# EAGLE design Current Sensor v0_6 (EAGLE 8.3.0)
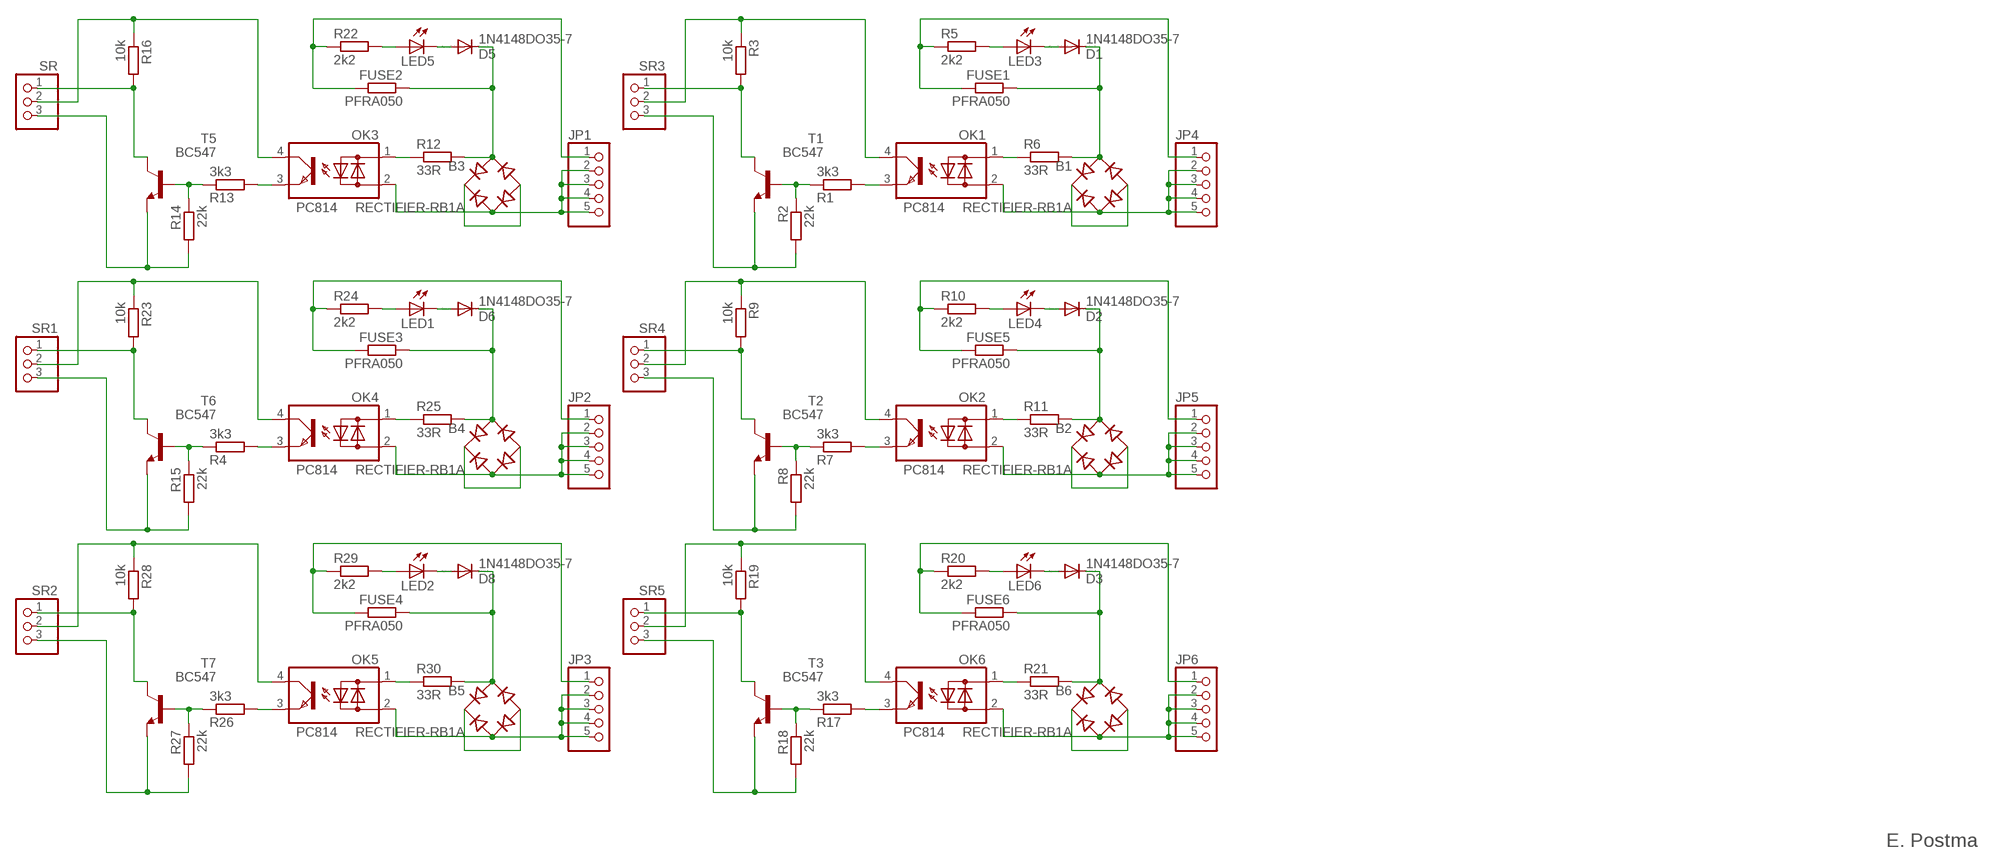
[diagram p0: schematic, sheet 1]

## Parts
B1  RECTIFIER-RB1A  [RB1A]
B2  RECTIFIER-RB1A  [RB1A]
B3  RECTIFIER-RB1A  [RB1A]
B4  RECTIFIER-RB1A  [RB1A]
B5  RECTIFIER-RB1A  [RB1A]
B6  RECTIFIER-RB1A  [RB1A]
D1  1N4148DO35-7  [DO35-7]
D2  1N4148DO35-7  [DO35-7]
D3  1N4148DO35-7  [DO35-7]
D5  1N4148DO35-7  [DO35-7]
D6  1N4148DO35-7  [DO35-7]
D8  1N4148DO35-7  [DO35-7]
FUSE1  PFRA050  R-EU_0414/5V  [0414V]
FUSE2  PFRA050  R-EU_0414/5V  [0414V]
FUSE3  PFRA050  R-EU_0414/5V  [0414V]
FUSE4  PFRA050  R-EU_0414/5V  [0414V]
FUSE5  PFRA050  R-EU_0414/5V  [0414V]
FUSE6  PFRA050  R-EU_0414/5V  [0414V]
JP1  PINHD-1X5  [1X05]
JP2  PINHD-1X5  [1X05]
JP3  PINHD-1X5  [1X05]
JP4  PINHD-1X5  [1X05]
JP5  PINHD-1X5  [1X05]
JP6  PINHD-1X5  [1X05]
LED1  LED3MM  [LED3MM]
LED2  LED3MM  [LED3MM]
LED3  LED3MM  [LED3MM]
LED4  LED3MM  [LED3MM]
LED5  LED3MM  [LED3MM]
LED6  LED3MM  [LED3MM]
OK1  PC814  [DIL04]
OK2  PC814  [DIL04]
OK3  PC814  [DIL04]
OK4  PC814  [DIL04]
OK5  PC814  [DIL04]
OK6  PC814  [DIL04]
R1  3k3  R-EU_0207/7  [0207/7]
R2  22k  R-EU_0207/7  [0207/7]
R3  10k  R-EU_0207/7  [0207/7]
R4  3k3  R-EU_0207/7  [0207/7]
R5  2k2  R-EU_0207/7  [0207/7]
R6  33R  R-EU_0207/7  [0207/7]
R7  3k3  R-EU_0207/7  [0207/7]
R8  22k  R-EU_0207/7  [0207/7]
R9  10k  R-EU_0207/7  [0207/7]
R10  2k2  R-EU_0207/7  [0207/7]
R11  33R  R-EU_0207/7  [0207/7]
R12  33R  R-EU_0207/7  [0207/7]
R13  3k3  R-EU_0207/7  [0207/7]
R14  22k  R-EU_0207/7  [0207/7]
R15  22k  R-EU_0207/7  [0207/7]
R16  10k  R-EU_0207/7  [0207/7]
R17  3k3  R-EU_0207/7  [0207/7]
R18  22k  R-EU_0207/7  [0207/7]
R19  10k  R-EU_0207/7  [0207/7]
R20  2k2  R-EU_0207/7  [0207/7]
R21  33R  R-EU_0207/7  [0207/7]
R22  2k2  R-EU_0207/7  [0207/7]
R23  10k  R-EU_0207/7  [0207/7]
R24  2k2  R-EU_0207/7  [0207/7]
R25  33R  R-EU_0207/7  [0207/7]
R26  3k3  R-EU_0207/7  [0207/7]
R27  22k  R-EU_0207/7  [0207/7]
R28  10k  R-EU_0207/7  [0207/7]
R29  2k2  R-EU_0207/7  [0207/7]
R30  33R  R-EU_0207/7  [0207/7]
SR  PINHD-1X3  [1X03]
SR1  PINHD-1X3  [1X03]
SR2  PINHD-1X3  [1X03]
SR3  PINHD-1X3  [1X03]
SR4  PINHD-1X3  [1X03]
SR5  PINHD-1X3  [1X03]
T1  BC547  [TO92]
T2  BC547  [TO92]
T3  BC547  [TO92]
T5  BC547  [TO92]
T6  BC547  [TO92]
T7  BC547  [TO92]

## Nets
N$1: OK3.1(AC1) R12.1
N$2: OK1.1(AC1) R6.1
N$3: LED3.A R5.2
N$4: D1.A LED3.K(C)
N$5 [Rijstroom+]: B1.AC1 D1.C FUSE1.1 R6.2
N$6 [Rijstroom+]: B1.+ B1.-
N$7 [Rijstroom+]: FUSE1.2 JP4.1 R5.1
N$8 [Rijstroom+]: B1.AC2 JP4.2 JP4.3 JP4.4 JP4.5 OK1.2(AC2)
N$9: R1.1 R2.1 T1.2(B)
N$10: R3.2 SR3.1 T1.3(C)
N$11: OK1.3(E) R1.2
N$12 [5V]: OK1.4(C) R3.1 SR3.2
N$13 [Gnd]: R2.2 SR3.3 T1.1(E)
N$14: OK2.1(AC1) R11.1
N$15: LED4.A R10.2
N$16: D2.A LED4.K(C)
N$17 [Rijstroom+]: B2.AC1 D2.C FUSE5.1 R11.2
N$18 [Rijstroom+]: B2.+ B2.-
N$19 [Rijstroom+]: FUSE5.2 JP5.1 R10.1
N$20 [Rijstroom+]: B2.AC2 JP5.2 JP5.3 JP5.4 JP5.5 OK2.2(AC2)
N$21: R7.1 R8.1 T2.2(B)
N$22: R9.2 SR4.1 T2.3(C)
N$23: OK2.3(E) R7.2
N$24: LED5.A R22.2
N$25: D5.A LED5.K(C)
N$26 [5V]: OK2.4(C) R9.1 SR4.2
N$27 [Gnd]: R8.2 SR4.3 T2.1(E)
N$28: OK6.1(AC1) R21.1
N$29: LED6.A R20.2
N$30 [Rijstroom+]: B3.AC1 D5.C FUSE2.1 R12.2
N$31: D3.A LED6.K(C)
N$32 [Rijstroom+]: B6.AC1 D3.C FUSE6.1 R21.2
N$33 [Rijstroom+]: B6.+ B6.-
N$34 [Rijstroom+]: FUSE6.2 JP6.1 R20.1
N$35 [Rijstroom+]: B6.AC2 JP6.2 JP6.3 JP6.4 JP6.5 OK6.2(AC2)
N$36 [Rijstroom+]: B3.+ B3.-
N$37 [Rijstroom+]: FUSE2.2 JP1.1 R22.1
N$38: R13.1 R14.1 T5.2(B)
N$39: R16.2 SR.1 T5.3(C)
N$40 [Rijstroom+]: B3.AC2 JP1.2 JP1.3 JP1.4 JP1.5 OK3.2(AC2)
N$41: R17.1 R18.1 T3.2(B)
N$42: R19.2 SR5.1 T3.3(C)
N$43: OK3.3(E) R13.2
N$44: OK4.1(AC1) R25.1
N$45 [5V]: OK3.4(C) R16.1 SR.2
N$46: OK6.3(E) R17.2
N$47: LED1.A R24.2
N$48: D6.A LED1.K(C)
N$49 [5V]: OK6.4(C) R19.1 SR5.2
N$50 [Gnd]: R18.2 SR5.3 T3.1(E)
N$51 [Rijstroom+]: B4.AC1 D6.C FUSE3.1 R25.2
N$52 [Rijstroom+]: B4.+ B4.-
N$53 [Rijstroom+]: FUSE3.2 JP2.1 R24.1
N$54 [Rijstroom+]: B4.AC2 JP2.2 JP2.3 JP2.4 JP2.5 OK4.2(AC2)
N$55: R4.1 R15.1 T6.2(B)
N$56: R23.2 SR1.1 T6.3(C)
N$57: OK4.3(E) R4.2
N$59 [5V]: OK4.4(C) R23.1 SR1.2
N$60 [Gnd]: R14.2 SR.3 T5.1(E)
N$61 [Gnd]: R15.2 SR1.3 T6.1(E)
N$62: OK5.1(AC1) R30.1
N$63: LED2.A R29.2
N$64: D8.A LED2.K(C)
N$65 [Rijstroom+]: B5.AC1 D8.C FUSE4.1 R30.2
N$66 [Rijstroom+]: B5.+ B5.-
N$67 [Rijstroom+]: FUSE4.2 JP3.1 R29.1
N$68 [Rijstroom+]: B5.AC2 JP3.2 JP3.3 JP3.4 JP3.5 OK5.2(AC2)
N$69: R26.1 R27.1 T7.2(B)
N$70: R28.2 SR2.1 T7.3(C)
N$71: OK5.3(E) R26.2
N$72 [5V]: OK5.4(C) R28.1 SR2.2
N$73 [Gnd]: R27.2 SR2.3 T7.1(E)

## Notes on the sheet
- E. Postma

## Library data of the parts
B1-B6 = rectifier:RECTIFIER-: Rectifier
D1-D3 D5 D6 D8 = diode:1N4148: DIODE high speed (Philips)
FUSE1-FUSE6 R1-R30 = resistor:R-EU_: RESISTOR, European symbol
JP1-JP6 = pinhead:PINHD-1X5: PIN HEADER
LED1-LED6 = led:LED: LED OSRAM: - CHIPLED LG R971, LG N971, LY N971, LG Q971, LY Q971, LO R971, LY R971 LH N974, LH R974 LS Q976, LO Q976, LY Q976 LO Q996 - Hyper CHIPLED LW Q18S LB Q993, LB Q99A, LB R99A - SideLED LS A670, LO A670, LY A670, LG A670, LP A670 LB A673, LV A673, LT A673, LW A673 LH A674 LY A675 LS A676, LA A676, LO A676, LY A676, LW A676 LS A679, LY A679, LG A679 - Hyper Micro SIDELED® LS Y876, LA Y876, LO Y876, LY Y876 LT Y87S - SmartLED LW L88C, LW L88S LB L89C, LB L89S, LG L890 LS L89K, LO L89K, LY L89K LS L896, LA L896, LO L896, LY L896 - TOPLED LS T670, LO T670, LY T670, LG T670, LP T670 LSG T670, LSP T670, LSY T670, LOP T670, LYG T670 LG T671, LOG T671, LSG T671 LB T673, LV T673, LT T673, LW T673 LH T674 LS T676, LA T676, LO T676, LY T676, LB T676, LH T676, LSB T676, LW T676 LB T67C, LV T67C, LT T67C, LS T67K, LO T67K, LY T67K, LW E67C LS E67B, LA E67B, LO E67B, LY E67B, LB E67C, LV E67C, LT E67C LW T67C LS T679, LY T679, LG T679 LS T770, LO T770, LY T770, LG T770, LP T770 LB T773, LV T773, LT T773, LW T773 LH T774 LS E675, LA E675, LY E675, LS T675 LS T776, LA T776, LO T776, LY T776, LB T776 LHGB T686 LT T68C, LB T68C - Hyper Mini TOPLED® LB M676 - Mini TOPLED Santana® LG M470 LS M47K, LO M47K, LY M47K Source: http://www.osram.convergy.de LUXEON: - LUMILED® LXK2-PW12-R00, LXK2-PW12-S00, LXK2-PW14-U00, LXK2-PW14-V00 LXK2-PM12-R00, LXK2-PM12-S00, LXK2-PM14-U00 LXK2-PE12-Q00, LXK2-PE12-R00, LXK2-PE12-S00, LXK2-PE14-T00, LXK2-PE14-U00 LXK2-PB12-K00, LXK2-PB12-L00, LXK2-PB12-M00, LXK2-PB14-N00, LXK2-PB14-P00, LXK2-PB14-Q00 LXK2-PR12-L00, LXK2-PR12-M00, LXK2-PR14-Q00, LXK2-PR14-R00 LXK2-PD12-Q00, LXK2-PD12-R00, LXK2-PD12-S00 LXK2-PH12-R00, LXK2-PH12-S00 LXK2-PL12-P00, LXK2-PL12-Q00, LXK2-PL12-R00 Source: www.luxeon.com KINGBRIGHT: KA-3528ASYC Source: www.kingbright.com
OK1-OK6 = optocoupler:PC814: SHARP OPTO COUPLER; OC_FARNELL: 9707662; OC_NEWARK: unknown
SR SR1-SR5 = pinhead:PINHD-1X3: PIN HEADER
T1-T3 T5-T7 = transistor:BC547: NPN TRANSISTOR

## Net classes
0 default: width 0.508 mm, clearance 0.254 mm
1 5V: width 0.762 mm, clearance 0.254 mm
2 Gnd: width 0.762 mm, clearance 0.254 mm
3 Extra: width 1.016 mm, clearance 0.254 mm
4 Rijstroom+: width 1.016 mm, clearance 0.254 mm
5 3.3V: width 0.508 mm, clearance 0.254 mm
6 Rijstroom-: width 1.016 mm, clearance 0.254 mm

## Board
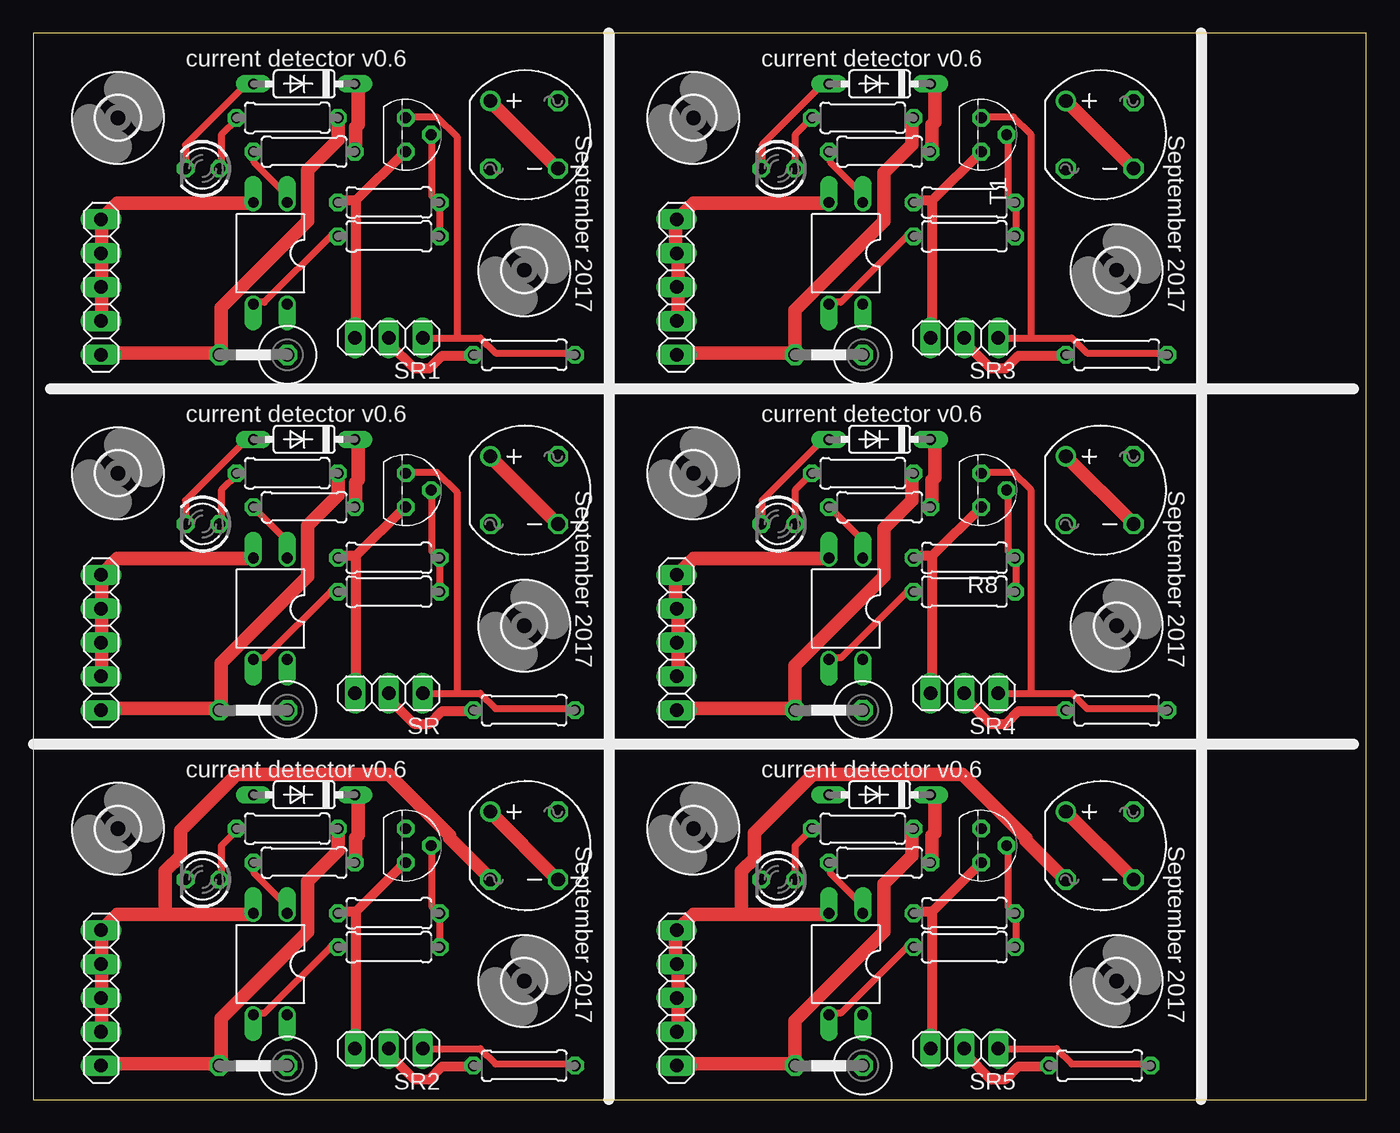
[diagram p1: board, top side]
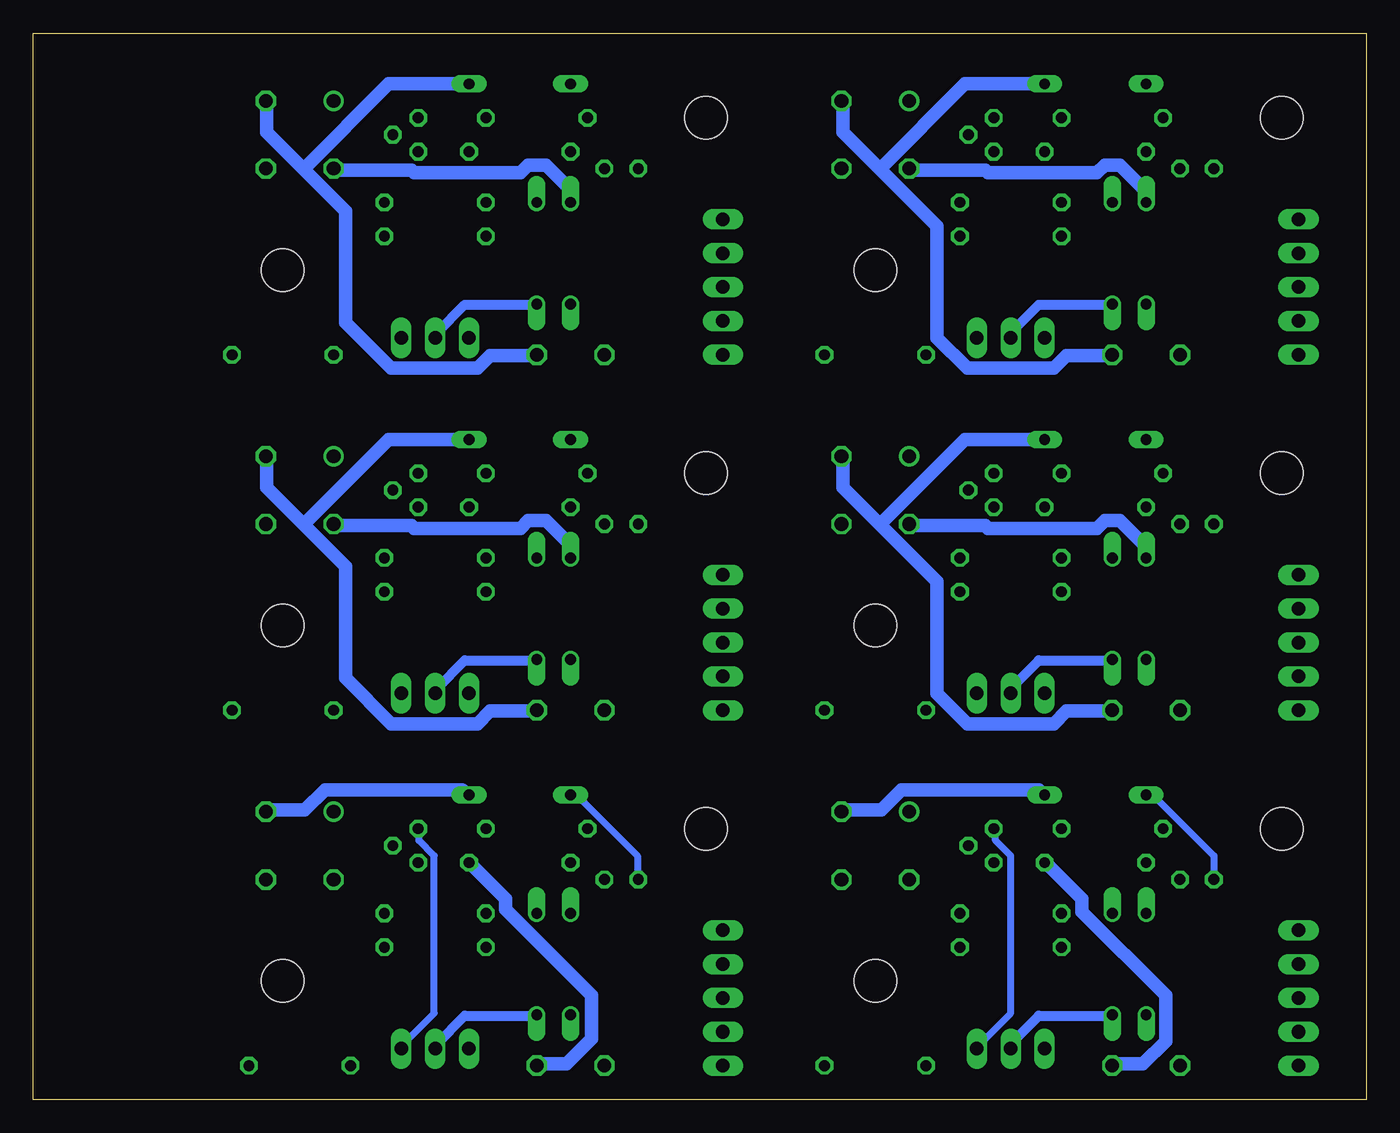
[diagram p2: board, bottom side, seen from below]

Size 100 x 80 mm. Coordinates in mm from the lower left corner, seen from the top.
Outline: 0,0 100,0 100,80 0,80 0,0
Copper layers (1*16): Top 0.035mm / dielectric 1.5mm / Bottom 0.035mm
Design rules "NOA Eagle Rule 2016-06-12": minimum track width 6mil, minimum drill 0.3mm, track to track 6mil, track to pad 6mil, pad to pad 6mil, via to via 6mil, smd to smd 0mil, copper to edge 0.4mm, drill to drill 10mil, minimum pad ring 10mil, minimum via ring 6mil, stop-mask expansion 2mil, vias tented up to drill 25mil, thermal gap 10mil

### Footprints (pad centres in the part's own frame; a part is rotated, then mirrored left to right if it is on the bottom)
RB1A = drill 1.016: + -2.54,2.54 | drill 1.016 octagon: - 2.54,-2.54; AC1 2.54,2.54; AC2 -2.54,-2.54
DO35-7 = drill 0.813 long: A 3.81,0; C -3.81,0
0414V = drill 1.016 octagon: 1 -2.54,0; 2 2.54,0
1X05 = drill 1.016 long: 1 -5.08,0; 2 -2.54,0; 3 0,0; 4 2.54,0; 5 5.08,0
LED3MM = drill 0.813 octagon: A -1.27,0; K 1.27,0
DIL04 = drill 0.813 offset: 1 -1.27,-3.81; 2 1.27,-3.81; 3 1.27,3.81; 4 -1.27,3.81
0207/7 = drill 0.813 octagon: 1 -3.81,0; 2 3.81,0
1X03 = drill 1.016 long: 1 -2.54,0; 2 0,0; 3 2.54,0
TO92 = drill 0.813 octagon: 1 1.27,0; 2 0,1.905; 3 -1.27,0
3,2 = hole 3.2: 0,0

### Placement (x,y rotation side)
B1  80.01,72.39 0 top
B2  80.01,45.72 0 top
B3  36.83,45.72 0 top
B4  36.83,72.39 0 top
B5  36.83,19.05 0 top
B6  80.01,19.05 0 top
D1  63.5,76.2 180 top
D2  63.5,49.53 180 top
D3  63.5,22.86 180 top
D5  20.32,49.53 180 top
D6  20.32,76.2 180 top
D8  20.32,22.86 180 top
FUSE1  59.69,55.88 180 top
FUSE2  16.51,29.21 180 top
FUSE3  16.51,55.88 180 top
FUSE4  16.51,2.54 180 top
FUSE5  59.69,29.21 180 top
FUSE6  59.69,2.54 180 top
JP1  5.08,34.29 90 top
JP2  5.08,60.96 90 top
JP3  5.08,7.62 90 top
JP4  48.26,60.96 90 top
JP5  48.26,34.29 90 top
JP6  48.26,7.62 90 top
LED1  12.7,69.85 180 top
LED2  12.7,16.51 180 top
LED3  55.88,69.85 180 top
LED4  55.88,43.18 180 top
LED5  12.7,43.18 180 top
LED6  55.88,16.51 180 top
OK1  60.96,63.5 180 top
OK2  60.96,36.83 180 top
OK3  17.78,36.83 180 top
OK4  17.78,63.5 180 top
OK5  17.78,10.16 180 top
OK6  60.96,10.16 180 top
R1  69.85,64.77 180 top
R2  69.85,67.31 180 top
R3  81.28,55.88 0 top
R4  26.67,64.77 180 top
R5  62.23,73.66 180 top
R6  63.5,71.12 0 top
R7  69.85,38.1 180 top
R8  69.85,40.64 180 top
R9  81.28,29.21 0 top
R10  62.23,46.99 180 top
R11  63.5,44.45 0 top
R12  20.32,44.45 0 top
R13  26.67,38.1 180 top
R14  26.67,40.64 180 top
R15  26.67,67.31 180 top
R16  36.83,29.21 0 top
R17  69.85,11.43 180 top
R18  69.85,13.97 180 top
R19  80.01,2.54 0 top
R20  62.23,20.32 180 top
R21  63.5,17.78 0 top
R22  19.05,46.99 180 top
R23  36.83,55.88 0 top
R24  19.05,73.66 180 top
R25  20.32,71.12 0 top
R26  26.67,11.43 180 top
R27  26.67,13.97 180 top
R28  36.83,2.54 0 top
R29  19.05,20.32 180 top
R30  20.32,17.78 0 top
SR  26.67,30.48 180 top
SR1  26.67,57.15 180 top
SR2  26.67,3.81 180 top
SR3  69.85,57.15 180 top
SR4  69.85,30.48 180 top
SR5  69.85,3.81 180 top
T1  71.12,72.39 270 top
T2  71.12,45.72 270 top
T3  71.12,19.05 270 top
T5  27.94,45.72 270 top
T6  27.94,72.39 270 top
T7  27.94,19.05 270 top
U$1  [3,2]  49.53,73.66 0 top
U$2  [3,2]  81.28,62.23 0 top
U$3  [3,2]  49.53,46.99 0 top
U$4  [3,2]  81.28,35.56 0 top
U$5  [3,2]  6.35,46.99 0 top
U$6  [3,2]  36.83,35.56 0 top
U$7  [3,2]  6.35,73.66 0 top
U$8  [3,2]  36.83,62.23 0 top
U$9  [3,2]  6.35,20.32 0 top
U$10  [3,2]  36.83,8.89 0 top
U$11  [3,2]  49.53,20.32 0 top
U$12  [3,2]  81.28,8.89 0 top

### Tracks (layer width: path | path; a pad name or v marks a point on that pad's centre or on a via)
N$1
  Top 0.508: OK3.1 19.05,41.91 R12.1
N$2
  Top 0.508: R6.1 59.82,71.06 59.82,70.29 62.1,68.01 62.1,67.44 OK1.1
N$3
  Top 0.508: LED3.A 57.15,72.39 R5.2
N$4
  Top 0.508: D1.A 59.24,76.2 54.67,71.63 54.67,69.91 LED3.K
N$5
  Top 1.016: R6.2 67.44,71.25 67.44,73.15 67.63,73.34 67.63,76.01 67.44,76.2 D1.C
  Bottom 1.016: 79.72,69.82 82.49,72.58 82.49,74.87 B1.AC1 | 79.72,69.82 76.58,66.67 76.58,58.29 73.15,54.86 66.67,54.86 65.72,55.82 62.29,55.82 FUSE1.1 | D1.C 73.34,76.2 79.72,69.82
N$6
  Top 1.016: B1.+ B1.-
N$7
  Top 1.016: R5.1 65.91,73.53 65.91,71.63 63.82,69.53 63.82,65.91 57.15,59.24 FUSE1.2 56.77,56.01 48.39,56.01 JP4.1
N$8
  Top 1.016: JP4.2 48.39,58.48 48.39,60.96 JP4.3 48.39,61.34 48.39,63.06 JP4.4 48.2,63.63 48.2,65.53 JP4.5 48.39,66.1 49.53,67.25 59.63,67.25 OK1.2
  Bottom 1.016: B1.AC2 77.34,69.72 71.63,69.72 71.44,69.53 63.44,69.53 62.87,70.1 61.53,70.1 59.82,68.39 59.82,67.44 OK1.2
N$9
  Top 0.508: R1.1 73.72,64.77 73.72,67.25 R2.1 73.15,67.82 73.15,72.39 T1.2
N$10
  Top 0.508: SR3.1 74.87,57.15 | 74.87,57.15 77.92,57.15 79.06,56.01 84.96,56.01 R3.2 | 74.87,57.15 74.87,72.39 73.53,73.72 71.25,73.72 T1.3
N$11
  Top 0.508: R1.2 65.53,64.77 60.58,59.82 59.82,59.82 OK1.3
N$12
  Top 0.762: R3.1 77.34,55.82 73.91,55.82 72.96,54.86 71.82,54.86 69.91,56.77 69.91,57.15 SR3.2
  Bottom 0.762: OK1.4 62.29,59.63 67.63,59.63 69.72,57.53 69.72,57.15 SR3.2
N$13
  Top 0.762: 67.44,67.44 66.1,67.44 R2.2 | T1.1 67.44,67.44 | 67.44,67.44 67.44,57.15 SR3.3
N$14
  Top 0.508: OK2.1 62.1,40.77 62.1,42.1 59.82,44.39 R11.1
N$15
  Top 0.508: LED4.A 57.15,45.72 R10.2
N$16
  Top 0.508: D2.A 59.24,49.53 54.67,44.96 54.67,43.24 LED4.K
N$17
  Top 1.016: R11.2 67.44,44.58 67.44,46.48 67.63,46.67 67.63,49.34 67.44,49.53 D2.C
  Bottom 1.016: 79.72,43.15 82.49,45.91 82.49,48.2 B2.AC1 | 79.72,43.15 76.58,40.01 76.58,31.62 73.15,28.19 66.67,28.19 65.72,29.15 62.29,29.15 FUSE5.1 | D2.C 73.34,49.53 79.72,43.15
N$18
  Top 1.016: B2.+ B2.-
N$19
  Top 1.016: R10.1 65.91,46.86 65.91,44.96 63.82,42.86 63.82,39.24 57.15,32.58 FUSE5.2 56.77,29.34 48.39,29.34 JP5.1
N$20
  Top 1.016: JP5.2 48.39,31.81 48.39,34.29 JP5.3 48.39,34.67 48.39,36.39 JP5.4 48.2,36.96 48.2,38.86 JP5.5 48.39,39.43 49.53,40.58 59.63,40.58 OK2.2
  Bottom 1.016: B2.AC2 77.34,43.05 71.63,43.05 71.44,42.86 63.44,42.86 62.87,43.43 61.53,43.43 59.82,41.72 59.82,40.77 OK2.2
N$21
  Top 0.508: R7.1 73.72,38.1 73.72,40.58 R8.1 73.15,41.15 73.15,45.72 T2.2
N$22
  Top 0.508: SR4.1 74.87,30.48 | 74.87,30.48 77.92,30.48 79.06,29.34 84.96,29.34 R9.2 | 74.87,30.48 74.87,45.72 73.53,47.05 71.25,47.05 T2.3
N$23
  Top 0.508: R7.2 65.53,38.1 60.58,33.15 59.82,33.15 OK2.3
N$24
  Top 0.508: LED5.A 14.1,43.24 14.1,45.72 15.24,46.86 R22.2
N$25
  Top 0.508: LED5.K 11.43,44.96 16,49.53 D5.A
N$26
  Top 0.762: R9.1 77.34,29.15 73.91,29.15 72.96,28.19 71.82,28.19 69.91,30.1 69.91,30.48 SR4.2
  Bottom 0.762: OK2.4 62.29,32.96 67.63,32.96 69.72,30.86 69.72,30.48 SR4.2
N$27
  Top 0.762: 67.44,40.77 66.1,40.77 R8.2 | T2.1 67.44,40.77 | 67.44,40.77 67.44,30.48 SR4.3
N$28
  Top 0.508: R21.1 59.82,17.72 59.82,16.95 62.1,14.67 62.1,14.1 OK6.1
N$29
  Top 0.508: LED6.A 57.15,19.05 R20.2
N$30
  Top 1.016: R12.2 24.19,44.58 24.19,46.29 24.38,46.48 24.38,49.34 24.19,49.53 D5.C
  Bottom 1.016: 36.48,43.15 39.24,45.91 39.24,48.2 B3.AC1 | 36.48,43.15 32.19,38.86 32.19,30.48 29.91,28.19 23.43,28.19 22.48,29.15 19.05,29.15 FUSE2.1 | D5.C 30.1,49.53 36.48,43.15
N$31
  Bottom 0.508: D3.A 59.24,22.86 54.67,18.29 54.67,16.57 LED6.K
N$32
  Top 1.016: R21.2 67.44,17.91 67.44,19.81 67.63,20 67.63,22.67 67.44,22.86 D3.C
  Bottom 1.016: R21.2 64.58,15.05 64.58,14.29 58.1,7.81 58.1,4.57 60.01,2.67 62.1,2.67 FUSE6.1 | B6.AC1 82.49,21.72 79.63,21.72 78.11,23.24 67.82,23.24 67.44,22.86 D3.C
N$33
  Top 1.016: B6.+ B6.-
N$34
  Top 1.016: R20.1 65.91,20.19 65.91,18.29 63.82,16.19 63.82,12.57 57.15,5.91 FUSE6.2 56.77,2.67 48.39,2.67 JP6.1
N$35
  Top 1.016: JP6.2 48.39,5.14 48.39,7.62 JP6.3 48.39,8 48.39,9.72 JP6.4 48.2,10.29 48.2,12.19 JP6.5 48.39,12.76 49.53,13.91 53.15,13.91 | 53.15,13.91 59.63,13.91 OK6.2 | 53.15,13.91 53.15,17.14 54.1,18.1 54.1,20 58.48,24.38 69.72,24.38 74.49,19.62 74.49,19.43 77.34,16.57 B6.AC2
N$36
  Top 1.016: B3.- 39.24,43.24 34.29,48.2 B3.+
N$37
  Top 1.016: R22.1 22.86,45.34 20.57,43.05 20.57,39.24 14.1,32.77 14.1,29.34 FUSE2.2 13.53,29.34 5.14,29.34 JP1.1
N$38
  Top 0.508: R13.1 R14.1 30.29,40.77 29.91,41.15 29.91,45.72 T5.2
N$39
  Top 0.508: SR.1 31.81,30.48 | 31.81,30.48 33.53,30.48 34.67,29.34 40.58,29.34 R16.2 | 31.81,30.48 31.81,45.53 30.29,47.05 28,47.05 T5.3
N$40
  Top 1.016: JP1.2 5.14,31.81 5.14,34.29 JP1.3 5.14,34.67 5.14,36.39 JP1.4 5.14,36.96 5.14,39.05 JP1.5 6.29,40.58 16.38,40.58 OK3.2
  Bottom 1.016: B3.AC2 34.29,43.05 28.57,43.05 28.38,42.86 20.19,42.86 19.62,43.43 18.48,43.43 16.57,41.53 16.57,40.77 OK3.2
N$41
  Top 0.508: R17.1 73.72,11.43 73.72,13.91 R18.1 73.15,14.48 73.15,19.05 T3.2
N$42
  Top 0.508: SR5.1 76.77,3.81 77.92,2.67 83.82,2.67 R19.2
  Bottom 0.508: SR5.1 72.39,4 69.91,6.48 69.91,18.29 71.06,19.43 71.06,20.19 T3.3
N$43
  Top 0.508: R13.2 22.29,38.1 17.34,33.15 16.57,33.15 OK3.3
N$44
  Top 0.508: OK4.1 19.05,67.82 16.57,70.29 16.57,71.06 R25.1
N$45
  Top 0.762: SR.2 26.67,30.1 28.57,28.19 29.72,28.19 30.67,29.15 32.96,29.15 R16.1
  Bottom 0.762: SR.2 26.67,30.86 24.57,32.96 19.05,32.96 OK3.4
N$46
  Top 0.508: R17.2 65.53,11.43 60.58,6.48 59.82,6.48 OK6.3
N$47
  Top 0.508: LED1.A 14.1,69.91 14.1,72.39 15.24,73.53 R24.2
N$48
  Top 0.508: LED1.K 11.43,71.63 16,76.2 D6.A
N$49
  Top 0.762: R19.1 76.2,2.48 73.91,2.48 72.96,1.52 71.82,1.52 69.91,3.43 69.91,3.81 SR5.2
  Bottom 0.762: OK6.4 62.29,6.29 67.63,6.29 69.72,4.19 69.72,3.81 SR5.2
N$50
  Top 0.762: 67.44,14.1 66.1,14.1 R18.2 | T3.1 67.44,14.1 | 67.44,14.1 67.44,3.81 SR5.3
N$51
  Top 1.016: R25.2 24.19,71.25 24.19,72.96 24.38,73.15 24.38,76.01 24.19,76.2 D6.C
  Bottom 1.016: 36.48,69.82 39.24,72.58 39.24,74.87 B4.AC1 | 36.48,69.82 32.19,65.53 32.19,57.15 29.91,54.86 23.43,54.86 22.48,55.82 19.05,55.82 FUSE3.1 | D6.C 30.1,76.2 36.48,69.82
N$52
  Top 1.016: B4.- 39.24,69.91 34.29,74.87 B4.+
N$53
  Top 1.016: R24.1 22.86,72.01 20.57,69.72 20.57,65.91 14.1,59.44 14.1,56.01 FUSE3.2 13.53,56.01 5.14,56.01 JP2.1
N$54
  Top 1.016: JP2.2 5.14,58.48 5.14,60.96 JP2.3 5.14,61.34 5.14,63.06 JP2.4 5.14,63.63 5.14,65.72 JP2.5 6.29,67.25 16.38,67.25 OK4.2
  Bottom 1.016: B4.AC2 34.29,69.72 28.57,69.72 28.38,69.53 20.19,69.53 19.62,70.1 18.48,70.1 16.57,68.2 16.57,67.44 OK4.2
N$55
  Top 0.508: R4.1 R15.1 30.29,67.44 29.91,67.82 29.91,72.39 T6.2
N$56
  Top 0.508: SR1.1 31.81,57.15 | 31.81,57.15 33.53,57.15 34.67,56.01 40.58,56.01 R23.2 | 31.81,57.15 31.81,72.2 30.29,73.72 28,73.72 T6.3
N$57
  Top 0.508: R4.2 22.29,64.77 17.34,59.82 16.57,59.82 OK4.3
N$59
  Top 0.762: SR1.2 26.67,56.77 28.57,54.86 29.72,54.86 30.67,55.82 32.96,55.82 R23.1
  Bottom 0.762: SR1.2 26.67,57.53 24.57,59.63 19.05,59.63 OK4.4
N$60
  Top 0.762: 24.19,40.77 22.86,40.77 R14.2 | 24.19,40.77 27.81,44.39 T5.1 | 24.19,40.77 24.19,30.48 SR.3
N$61
  Top 0.762: 24.19,67.44 22.86,67.44 R15.2 | 24.19,67.44 27.81,71.06 T6.1 | 24.19,67.44 24.19,57.15 SR1.3
N$62
  Top 0.508: OK5.1 19.05,14.48 16.57,16.95 16.57,17.72 R30.1
N$63
  Top 0.508: LED2.A 14.1,16.57 14.1,19.05 15.24,20.19 R29.2
N$64
  Bottom 0.508: LED2.K 11.43,18.29 16,22.86 D8.A
N$65
  Top 1.016: R30.2 24.19,17.91 24.19,19.62 24.38,19.81 24.38,22.67 24.19,22.86 D8.C
  Bottom 1.016: FUSE4.1 19.05,2.67 16.76,2.67 15.05,4.38 15.05,7.81 21.34,14.1 21.34,15.05 24,17.72 R30.2 | B5.AC1 39.24,21.72 36.39,21.72 34.86,23.24 24.57,23.24 24.19,22.86 D8.C
N$66
  Top 1.016: B5.- 39.24,16.57 34.29,21.53 B5.+
N$67
  Top 1.016: R29.1 22.86,18.67 20.57,16.38 20.57,12.57 14.1,6.1 14.1,2.67 FUSE4.2 13.53,2.67 5.14,2.67 JP3.1
N$68
  Top 1.016: JP3.2 5.14,5.14 5.14,7.62 JP3.3 5.14,8 5.14,9.72 JP3.4 5.14,10.29 5.14,12.38 JP3.5 6.29,13.91 9.91,13.91 | 9.91,13.91 16.38,13.91 OK5.2 | 9.91,13.91 9.91,17.14 11.05,18.29 11.05,20.19 15.24,24.38 26.67,24.38 31.24,19.81 31.24,19.62 34.29,16.57 B5.AC2
N$69
  Top 0.508: R26.1 R27.1 30.29,14.1 29.91,14.48 29.91,19.05 T7.2
N$70
  Top 0.508: SR2.1 33.53,3.81 34.67,2.67 40.58,2.67 R28.2
  Bottom 0.508: T7.3 27.81,20.19 27.81,19.43 26.67,18.29 26.67,6.48 29.34,3.81 SR2.1
N$71
  Top 0.508: R26.2 22.29,11.43 17.34,6.48 16.57,6.48 OK5.3
N$72
  Top 0.762: SR2.2 26.67,3.43 28.57,1.52 29.72,1.52 30.67,2.48 32.96,2.48 R28.1
  Bottom 0.762: SR2.2 26.67,4.19 24.57,6.29 19.05,6.29 OK5.4
N$73
  Top 0.762: 24.19,14.1 22.86,14.1 R27.2 | 24.19,14.1 27.81,17.72 T7.1 | 24.19,14.1 24.19,3.81 SR2.3

### Text on the board
tNames: current detector v0.6 | current detector v0.6 | September 2017 | September 2017 | current detector v0.6 | current detector v0.6 | September 2017 | September 2017 | current detector v0.6 | current detector v0.6 | September 2017 | September 2017